# Altium project Board_MCU_v7.PrjPCB
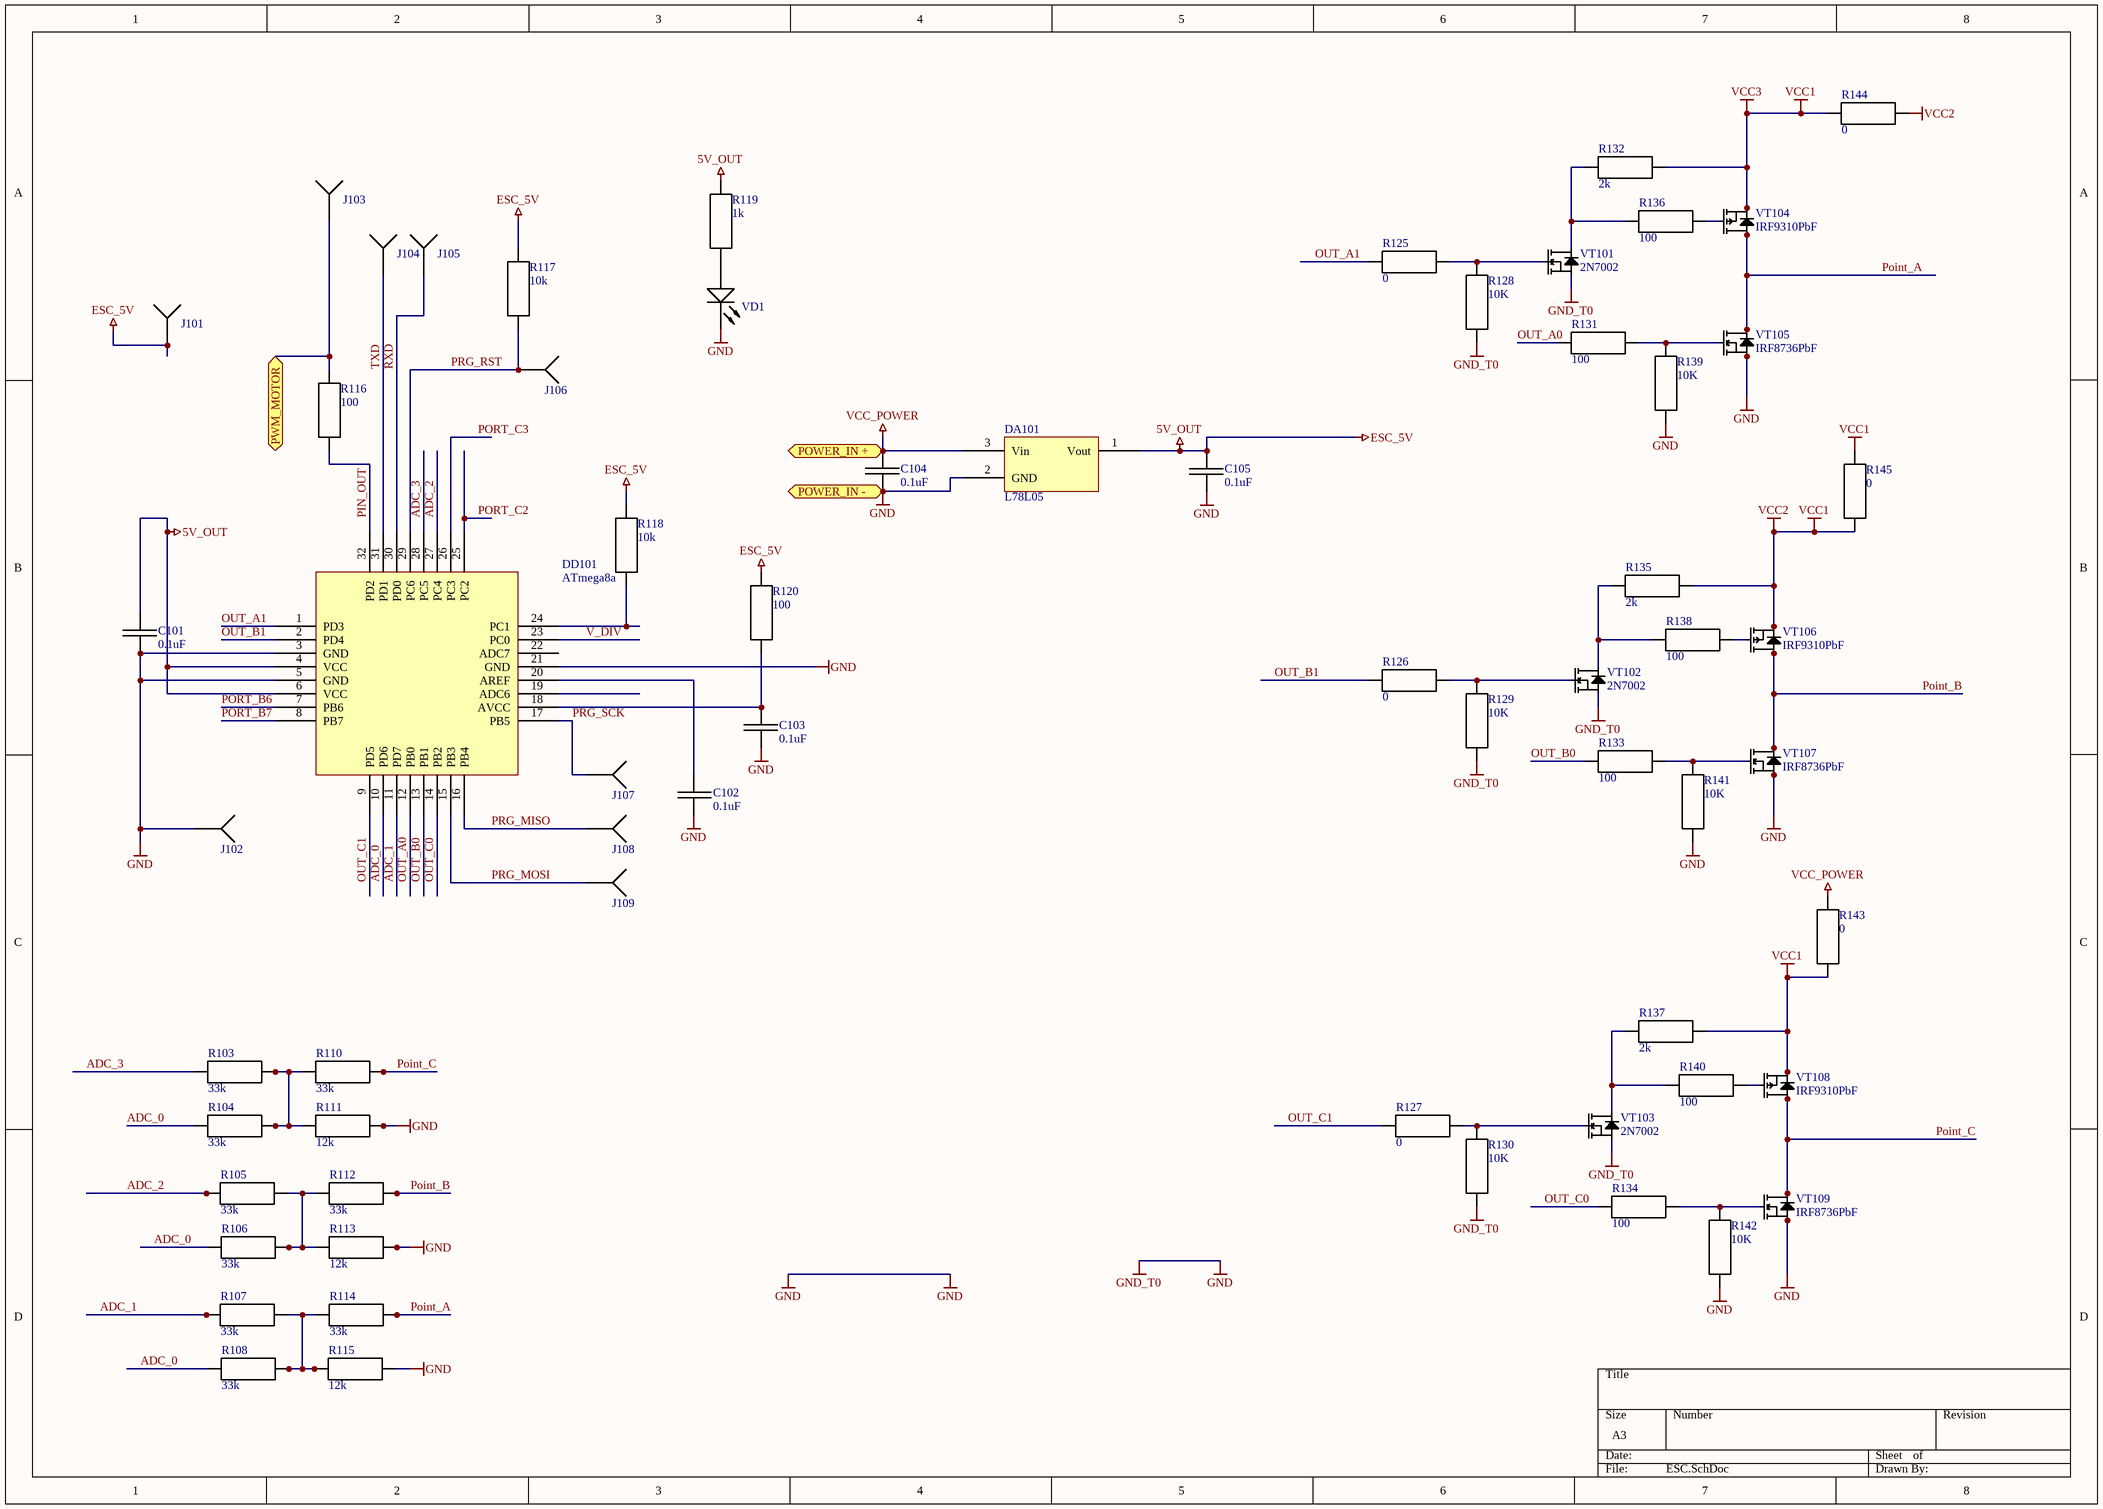
[diagram p0: ESC.SchDoc]
3 sheets, 124 parts. Net scope: flat (ports and power ports of the same name join across sheets).
Board files: ESC_v7.PcbDoc, Board_MCU_v7.PcbDoc
Sheets:
  ESC.SchDoc
  Board_MCU.SchDoc
  BatteryProtection.SchDoc

## Sheet ESC.SchDoc
size A3

### Parts
C101  0.1uF  [CAP0805]
C102  0.1uF  [CAP0805]
C103  0.1uF  [CAP0805]
C104  0.1uF  [CAP0805]
C105  0.1uF  [CAP0805]
DA101  L78L05  [SOT89]
DD101  ATmega8a  [ATMEGA8A]
J101  X-Socket  [Socket]  (value not drawn)
J102  X-Socket  [Socket]  (value not drawn)
J103  X-Socket  [Socket]  (value not drawn)
J104  X-Socket  [Socket]  (value not drawn)
J105  X-Socket  [Socket]  (value not drawn)
J106  X-Socket  [Socket]  (value not drawn)
J107  X-Socket  [Socket]  (value not drawn)
J108  X-Socket  [Socket]  (value not drawn)
J109  X-Socket  [Socket]  (value not drawn)
R103  33k  [RES0603]
R104  33k  [RES0603]
R105  33k  [RES0603]
R106  33k  [RES0603]
R107  33k  [RES0603]
R108  33k  [RES0603]
R110  33k  [RES0603]
R111  12k  [RES0603]
R112  33k  [RES0603]
R113  12k  [RES0603]
R114  33k  [RES0603]
R115  12k  [RES0603]
R116  100  [RES0805]
R117  10k  [RES0805]
R118  10k  [RES0805]
R119  1k  [RES0603]
R120  100  [RES0603]
R125  0  [RES1206]
R126  0  [RES1206]
R127  0  [RES0805]
R128  10K  [RES0603]
R129  10K  [RES0603]
R130  10K  [RES0603]
R131  100  [RES0603]
R132  2k  [RES0603]
R133  100  [RES0603]
R134  100  [RES0603]
R135  2k  [RES0603]
R136  100  [RES0603]
R137  2k  [RES0603]
R138  100  [RES0603]
R139  10K  [RES0603]
R140  100  [RES0603]
R141  10K  [RES0603]
R142  10K  [RES0603]
R143  0  [RES2512]
R144  0  [RES1206]
R145  0  [RES1206]
VD1  KP-1608SURC  [Diode 1608]  (value not drawn)
VT101  2N7002  [SOT23]
VT102  2N7002  [SOT23]
VT103  2N7002  [SOT23]
VT104  IRF9310PbF  [SO-8 IRF...]
VT105  IRF8736PbF  [SO-8 IRF...]
VT106  IRF9310PbF  [SO-8 IRF...]
VT107  IRF8736PbF  [SO-8 IRF...]
VT108  IRF9310PbF  [SO-8 IRF...]
VT109  IRF8736PbF  [SO-8 IRF...]

### Ports
POWER_IN +, POWER_IN -, PWM_MOTOR

### Nets
5V_OUT: C101.1 C105.1 DA101.1(Vout) DD101.4(VCC) DD101.6(VCC) J101.1 R117.2 R118.2 R119.1 R120.2  [also labelled ESC_5V]
GND: C101.2 C102.1 C103.2 C104.2 C105.2 DA101.2(GND) DD101.3(GND) DD101.5(GND) DD101.21(GND) J102.1 R111.1 R113.1 R115.1 R128.1 R129.1 R130.1 R139.1 R141.1 R142.1 VD1.1 VT101.2(S) VT102.2(S) VT103.2(S) VT105.1(S) VT105.2(S) VT105.3(S) VT107.1(S) VT107.2(S) VT107.3(S) VT109.1(S) VT109.2(S) VT109.3(S) ; port POWER_IN -  [also labelled GND_T0]  [project net - BATT_OUT]
VCC1: R132.1 R135.1 R137.1 R143.1 R144.1 R144.2 R145.1 R145.2 VT104.1(S) VT104.2(S) VT104.3(S) VT106.1(S) VT106.2(S) VT106.3(S) VT108.1(S) VT108.2(S) VT108.3(S)  [also labelled VCC2, VCC3]
VCC_POWER: C104.1 DA101.3(Vin) R143.2 ; port POWER_IN +  [project net + BATT_OUT]
ADC_0: DD101.10(PD6) R104.2 R106.2 R108.2
ADC_1: DD101.11(PD7) R107.2
ADC_2: DD101.27(PC4) R105.2
ADC_3: DD101.28(PC5) R103.2
OUT_A0: DD101.12(PB0) R131.1
OUT_A1: DD101.1(PD3) R125.2
OUT_B0: DD101.13(PB1) R133.1
OUT_B1: DD101.2(PD4) R126.2
OUT_C0: DD101.14(PB2) R134.1
OUT_C1: DD101.9(PD5) R127.2
PIN_OUT: DD101.32(PD2) R116.2
Point_A: R114.1 VT104.5(D) VT104.6(D) VT104.7(D) VT104.8(D) VT105.5(D) VT105.6(D) VT105.7(D) VT105.8(D)
Point_B: R112.1 VT106.5(D) VT106.6(D) VT106.7(D) VT106.8(D) VT107.5(D) VT107.6(D) VT107.7(D) VT107.8(D)
Point_C: R110.1 VT108.5(D) VT108.6(D) VT108.7(D) VT108.8(D) VT109.5(D) VT109.6(D) VT109.7(D) VT109.8(D)
PORT_B6: DD101.7(PB6)
PORT_B7: DD101.8(PB7)
PORT_C2: DD101.25(PC2)
PORT_C3: DD101.26(PC3)
PRG_MISO: DD101.16(PB4) J108.1
PRG_MOSI: DD101.15(PB3) J109.1
PRG_RST: DD101.29(PC6) J106.1 R117.1
PRG_SCK: DD101.17(PB5) J107.1
RXD: DD101.30(PD0) J105.1
TXD: DD101.31(PD1) J104.1
V_DIV: DD101.23(PC0)
NetC102_2: C102.2 DD101.20(AREF)
NetC103_1: C103.1 DD101.18(AVCC) R120.1
NetDD101_24: DD101.24(PC1) R118.1
NetJ103_1: J103.1 R116.1 ; port PWM_MOTOR
NetR103_1: R103.1 R104.1 R110.2 R111.2
NetR105_1: R105.1 R106.1 R112.2 R113.2
NetR107_1: R107.1 R108.1 R114.2 R115.2
NetR119_2: R119.2 VD1.2
NetR125_1: R125.1 R128.2 VT101.1(G)
NetR126_1: R126.1 R129.2 VT102.1(G)
NetR127_1: R127.1 R130.2 VT103.1(G)
NetR131_2: R131.2 R139.2 VT105.4(G)
NetR132_2: R132.2 R136.1 VT101.3(D)
NetR133_2: R133.2 R141.2 VT107.4(G)
NetR134_2: R134.2 R142.2 VT109.4(G)
NetR135_2: R135.2 R138.1 VT102.3(D)
NetR136_2: R136.2 VT104.4(G)
NetR137_2: R137.2 R140.1 VT103.3(D)
NetR138_2: R138.2 VT106.4(G)
NetR140_2: R140.2 VT108.4(G)

Not connected (* = marked no-connect by the designer): DD101 19(ADC6) 22(ADC7)

### Library data of the parts
C101-C105 = Capacitor: Voltage: 50V; dielectric: X7R; Value: 0.1uF
DA101 = DA-L78L05: LDO; Iout: 0.1A; Vin max: 40 V; Vout: 5V
DD101 = ATmega8a: MCU 8MHz
R103-R108 R110-R120 R125-R145 = Resistor: Toleance: 1%
  R103-R108 R110 R112 R114: Value: 33k
  R111 R113 R115: Value: 12k
  R116 R120 R131 R133 R134 R136 R138 R140: Value: 100
  R117 R118: Value: 10k
  R119: Value: 1k
  R125-R127 R143-R145: Value: 0
  R128-R130 R139 R141 R142: Value: 10K
  R132 R135 R137: Value: 2k
VD1 = LED_0603: Imax: 30mA; Inorm: 20mA
VT101-VT103 = 2N7002: Vds: 60V; Rds: 2-4; Id: 300mA; Vgs: 1...2.5V
VT104 VT106 VT108 = IRF9310PbF: P-MOSFET -20A; Vds: -30V; Vgs: +-20V; Pd: 2.5W; Vgs(th): -1.3...-1.8...-2.4; Qg: 58nC; Rds(on): 0.0039...0.0046; Id: -20A
VT105 VT107 VT109 = IRF8736PbF: N-MOSFET 18A; Vds: 30V; Pd: 2.5W; Rds(on): 0.0039-0.006.8; Vgs(th): 1.35...1.8...2.35V; Qg: 17...26nC; Id: 18A

## Sheet Board_MCU.SchDoc
size A4
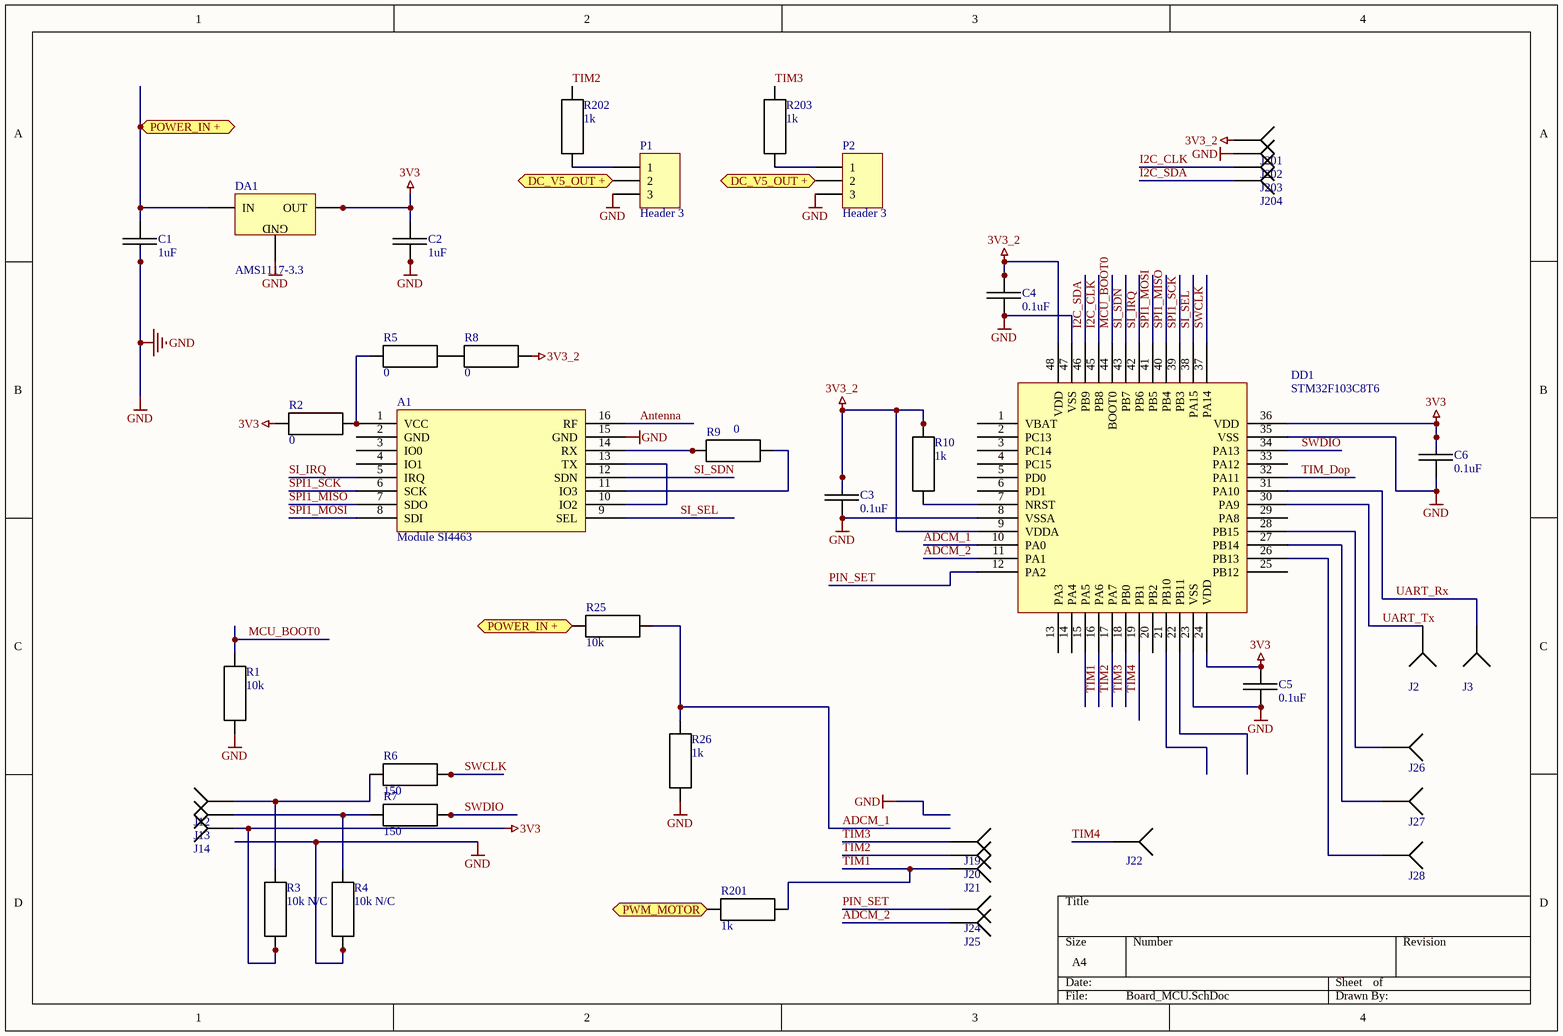
[diagram p1: Board_MCU.SchDoc]

### Parts
A1  Module SI4463  [MODULE_SI44663]
C1  1uF  [CAP0805]
C2  1uF  [CAP0805]
C3  0.1uF  [CAP0805]
C4  0.1uF  [CAP0805]
C5  0.1uF  [CAP0805]
C6  0.1uF  [CAP0805]
DA1  AMS1117-3.3  [SOT-223]
DD1  STM32F103C8T6  [STM32L151C]
J2  X-Socket  [Socket]  (value not drawn)
J3  X-Socket  [Socket]  (value not drawn)
J12  X-Socket  [Socket]  (value not drawn)
J13  X-Socket  [Socket]  (value not drawn)
J14  X-Socket  [Socket]  (value not drawn)
J19  X-Socket  [Socket]  (value not drawn)
J20  X-Socket  [Socket]  (value not drawn)
J21  X-Socket  [Socket]  (value not drawn)
J22  X-Socket  [Socket]  (value not drawn)
J24  X-Socket  [Socket]  (value not drawn)
J25  X-Socket  [Socket]  (value not drawn)
J26  X-Socket  [Socket]  (value not drawn)
J27  X-Socket  [Socket]  (value not drawn)
J28  X-Socket  [Socket]  (value not drawn)
J201  X-Socket  [Socket]  (value not drawn)
J202  X-Socket  [Socket]  (value not drawn)
J203  X-Socket  [Socket]  (value not drawn)
J204  X-Socket  [Socket]  (value not drawn)
P1  Header 3  [HDR1X3]
P2  Header 3  [HDR1X3]
R1  10k  [RES0805]
R2  0  [RES0805]
R3  10k N/C  [RES0603]
R4  10k N/C  [RES0603]
R5  0  [RES0805]
R6  150  [RES0603]
R7  150  [RES0603]
R8  0  [RES0805]
R9  0  [RES0603]
R10  1k  [RES0805]
R25  10k  [RES0805]
R26  1k  [RES0805]
R201  1k  [RES0805]
R202  1k  [RES0805]
R203  1k  [RES0805]

### Ports
DC_V5_OUT +, POWER_IN +, PWM_MOTOR

### Nets
3V3: C2.1 C5.1 C6.1 DA1.2(OUT) DA1.4 DD1.24(VDD) DD1.36(VDD) J14.1 R2.1 R3.2
3V3_2: C3.1 C4.1 DD1.9(VDDA) DD1.48(VDD) J201.1 R8.2 R10.1
+ BATT_OUT: C1.1 DA1.3(IN) R25.1 ; port POWER_IN +
GND: A1.15(GND) C1.2 C2.2 C3.2 C4.2 C5.2 C6.2 DA1.1(GND) DD1.8(VSSA) DD1.23(VSS) DD1.35(VSS) DD1.47(VSS) J202.1 P1.3 P2.3 R1.2 R4.2 R26.2  [project net - BATT_OUT]
ADCM_1: DD1.10(PA0) R25.2 R26.1
ADCM_2: DD1.11(PA1) J25.1
Antenna: A1.16(RF)
I2C_CLK: DD1.45(PB8) J203.1
I2C_SDA: DD1.46(PB9) J204.1
MCU_BOOT0: DD1.44(BOOT0) R1.1
PIN_SET: DD1.12(PA2) J24.1
SI_IRQ: A1.5(IRQ) DD1.42(PB6)
SI_SDN: A1.12(SDN) DD1.43(PB7)
SI_SEL: A1.9(SEL) DD1.38(PA15)
SPI1_MISO: A1.7(SDO) DD1.40(PB4)
SPI1_MOSI: A1.8(SDI) DD1.41(PB5)
SPI1_SCK: A1.6(SCK) DD1.39(PB3)
SWCLK: DD1.37(PA14) R6.1
SWDIO: DD1.34(PA13) R7.1
TIM1: DD1.16(PA6) J21.1 R201.2
TIM2: DD1.17(PA7) J20.1 R202.2
TIM3: DD1.18(PB0) J19.1 R203.2
TIM4: DD1.19(PB1) J22.1
TIM_Dop: DD1.32(PA11)
UART_Rx: DD1.31(PA10) J3.1
UART_Tx: DD1.30(PA9) J2.1
NetA1_1: A1.1(VCC) R2.2 R5.1
NetA1_10: A1.10(IO2) A1.13(TX)
NetA1_11: A1.11(IO3) R9.2
NetA1_14: A1.14(RX) R9.1
NetC8_1: P1.2 P2.2 ; port DC_V5_OUT +
NetDD1_7: DD1.7(NRST) R10.2
NetDD1_26: DD1.26(PB13) J28.1
NetDD1_27: DD1.27(PB14) J27.1
NetDD1_28: DD1.28(PB15) J26.1
NetJ12_1: J12.1 R3.1 R6.2
NetJ13_1: J13.1 R4.1 R7.2
NetJ103_1: R201.1 ; port PWM_MOTOR
NetP1_1: P1.1 R202.1
NetP2_1: P2.1 R203.1
NetR5_2: R5.2 R8.1

Not connected (* = marked no-connect by the designer): A1 2(GND) 3(IO0) 4(IO1); DD1 1(VBAT) 2(PC13) 3(PC14) 4(PC15) 5(PD0) 6(PD1) 13(PA3) 14(PA4) 15(PA5) 20(PB2) 21(PB10) 22(PB11) 25(PB12) 29(PA8) 33(PA12)

### Library data of the parts
A1 = module_SI4463: VCC: 3V3
C1-C6 = Capacitor: Voltage: 50V; dielectric: X7R
  C1 C2: Value: 1uF
  C3-C6: Value: 0.1uF
DA1 = DA-AMS1117: LDO 3.3V 0.5A; Vin: ...15V; Iout: 1.5A; Vout: 3.3
DD1 = STM32F103C8T6: LQFP48
P1 P2 = Header 3: Header, 3-Pin; LatestRevisionDate: 17-Jul-2002; LatestRevisionNote: Re-released for DXP Platform.; Publisher: Altium Limited
R1-R10 R25 R26 R201-R203 = Resistor: Toleance: 1%
  R1 R25: Value: 10k
  R2 R5 R8 R9: Value: 0
  R3 R4: DNI: N/C; Value: 10k
  R6 R7: Value: 150
  R10 R26 R201-R203: Value: 1k

## Sheet BatteryProtection.SchDoc
size A3
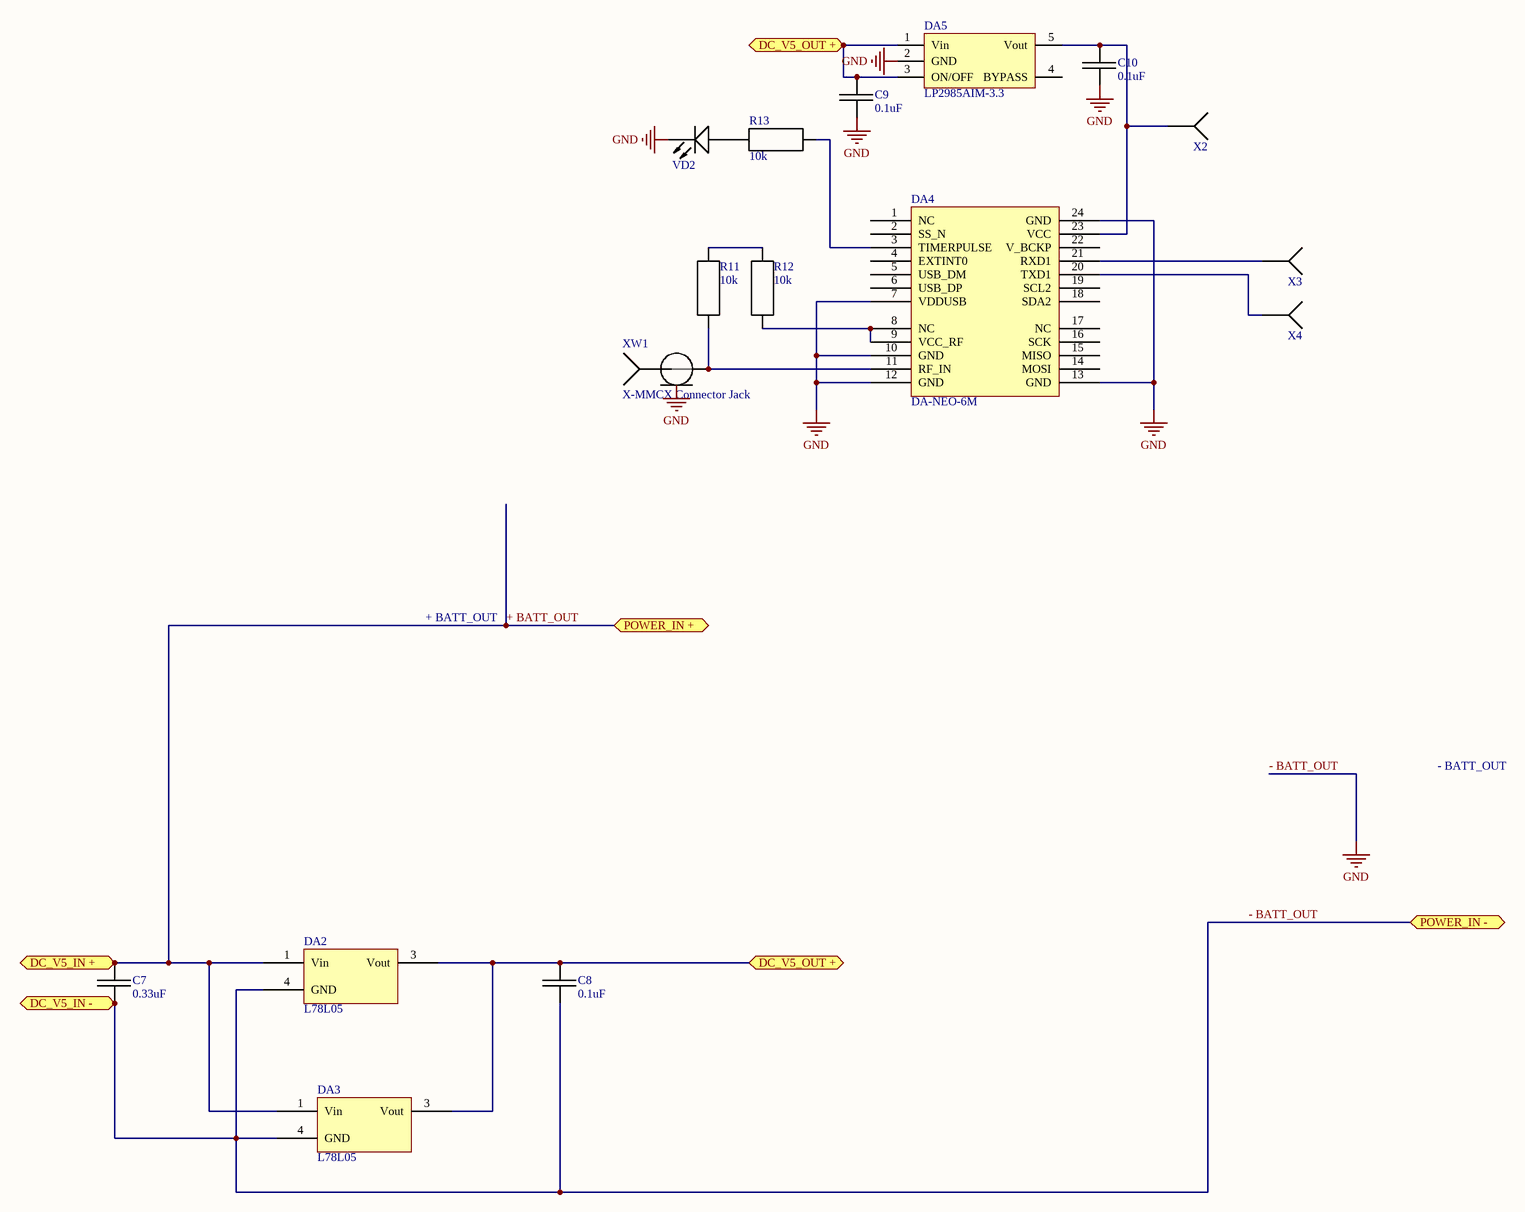
[diagram p2: BatteryProtection.SchDoc]

### Parts
C7  0.33uF  [CAP0805]
C8  0.1uF  [CAP0805]
C9  0.1uF  [CAP0805]
C10  0.1uF  [CAP0805]
DA2  L78L05  [TO-252AA]
DA3  L78L05  [TO-252AA]
DA4  DA-NEO-6M  [NEO-6M]
DA5  LP2985AIM-3.3  [SOT-23]
R11  10k  [RES0805]
R12  10k  [RES0805]
R13  10k  [RES0805]
VD2  KP-1608SURC  [Diode 1608]  (value not drawn)
X2  X-Socket  [Socket]  (value not drawn)
X3  X-Socket  [Socket]  (value not drawn)
X4  X-Socket  [Socket]  (value not drawn)
XW1  X-MMCX Connector Jack  [X-MMCX]

### Ports
DC_V5_IN +, DC_V5_IN -, DC_V5_OUT +, POWER_IN +, POWER_IN -

### Nets
+ BATT_OUT: C7.1 DA2.1(Vin) DA3.1(Vin) ; port DC_V5_IN +, port POWER_IN +
- BATT_OUT: C7.2 C8.2 C9.2 C10.2 DA2.4(GND) DA3.4(GND) DA4.7(VDDUSB) DA4.10(GND) DA4.12(GND) DA4.13(GND) DA4.24(GND) DA5.2(GND) VD2.1 XW1.2 ; port DC_V5_IN -, port POWER_IN -  [also labelled GND]
NetC8_1: C8.1 C9.1 DA2.3(Vout) DA3.3(Vout) DA5.1(Vin) DA5.3(ON/OFF) ; port DC_V5_OUT +
NetC10_1: C10.1 DA4.23(VCC) DA5.5(Vout) X2.1
NetDA4_3: DA4.3(TIMERPULSE) R13.2
NetDA4_8: DA4.8(NC) DA4.9(VCC_RF) R12.2
NetDA4_11: DA4.11(RF_IN) R11.2 XW1.1
NetDA4_20: DA4.20(TXD1) X4.1
NetDA4_21: DA4.21(RXD1) X3.1
NetR11_1: R11.1 R12.1
NetR13_1: R13.1 VD2.2

Not connected (* = marked no-connect by the designer): DA4 1(NC) 2(SS_N) 4(EXTINT0) 5(USB_DM) 6(USB_DP) 14(MOSI) 15(MISO) 16(SCK) 17(NC) 18(SDA2) 19(SCL2) 22(V_BCKP); DA5 4(BYPASS)

### Notes on the sheet
- + BATT_OUT
- - BATT_OUT

### Library data of the parts
C7-C10 = Capacitor: Voltage: 50V; dielectric: X7R
  C7: Value: 0.33uF
  C8-C10: Value: 0.1uF
DA2 DA3 = DA-L78M05: LDO; Iout: 0.5A; Vin max: 35 V; Vout: 5V
DA5 = DA-LP2985: LDO; Iout: 0.15A; Vin max: 16 V
R11-R13 = Resistor: Toleance: 1%; Value: 10k
VD2 = LED_0603: Imax: 30mA; Inorm: 20mA

## Nets that join several sheets
+ BATT_OUT: ESC (C104.1 DA101.3 R143.2), Board_MCU (C1.1 DA1.3 R25.1), BatteryProtection (C7.1 DA2.1 DA3.1)
- BATT_OUT: ESC (32 pins), Board_MCU (18 pins), BatteryProtection (14 pins)
NetC8_1: Board_MCU (P1.2 P2.2), BatteryProtection (6 pins)
NetJ103_1: ESC (J103.1 R116.1), Board_MCU (R201.1)